# Altium schematic sheet Vanilla SCB.SchDoc: Vanilla SCB
size A4; Organization: Bjørn T. Brodtkorb; Address1: Frode Rinnans veg 161; Address2: 7050 Trondheim; DocumentNumber: 1; Revision: 1.0; SheetNumber: 1; SheetTotal: 13
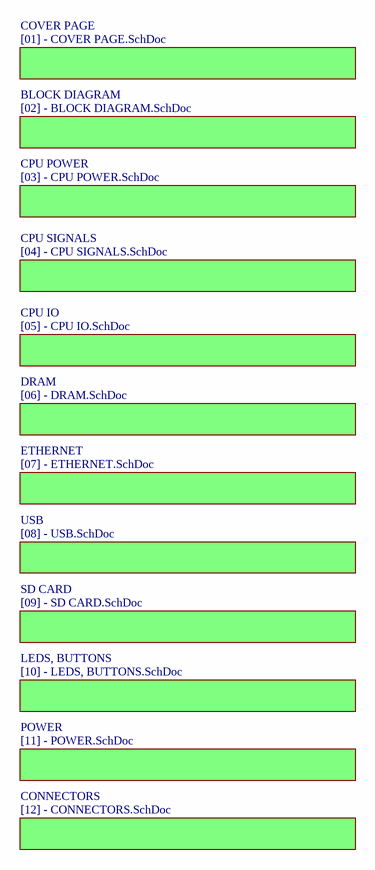
[diagram p0: Vanilla SCB.SchDoc]

## Sub-sheets
BLOCK DIAGRAM = [02] - BLOCK DIAGRAM.SchDoc: no entries
CONNECTORS = [12] - CONNECTORS.SchDoc: no entries
COVER PAGE = [01] - COVER PAGE.SchDoc: no entries
CPU IO = [05] - CPU IO.SchDoc: no entries
CPU POWER = [03] - CPU POWER.SchDoc: no entries
CPU SIGNALS = [04] - CPU SIGNALS.SchDoc: no entries
DRAM = [06] - DRAM.SchDoc: no entries
ETHERNET = [07] - ETHERNET.SchDoc: no entries
LEDS, BUTTONS = [10] - LEDS, BUTTONS.SchDoc: no entries
POWER = [11] - POWER.SchDoc: no entries
SD CARD = [09] - SD CARD.SchDoc: no entries
USB = [08] - USB.SchDoc: no entries

## Notes on the sheet
- Title
- Size:
- Date:
- A4
- Number:
- Time:
- Revision:
- Sheet
- of
- StrawberryHacker
- File: